# Altium schematic sheet Power.SchDoc
size 420 x 297 mm; SheetNumber: 2; SheetTotal: 4
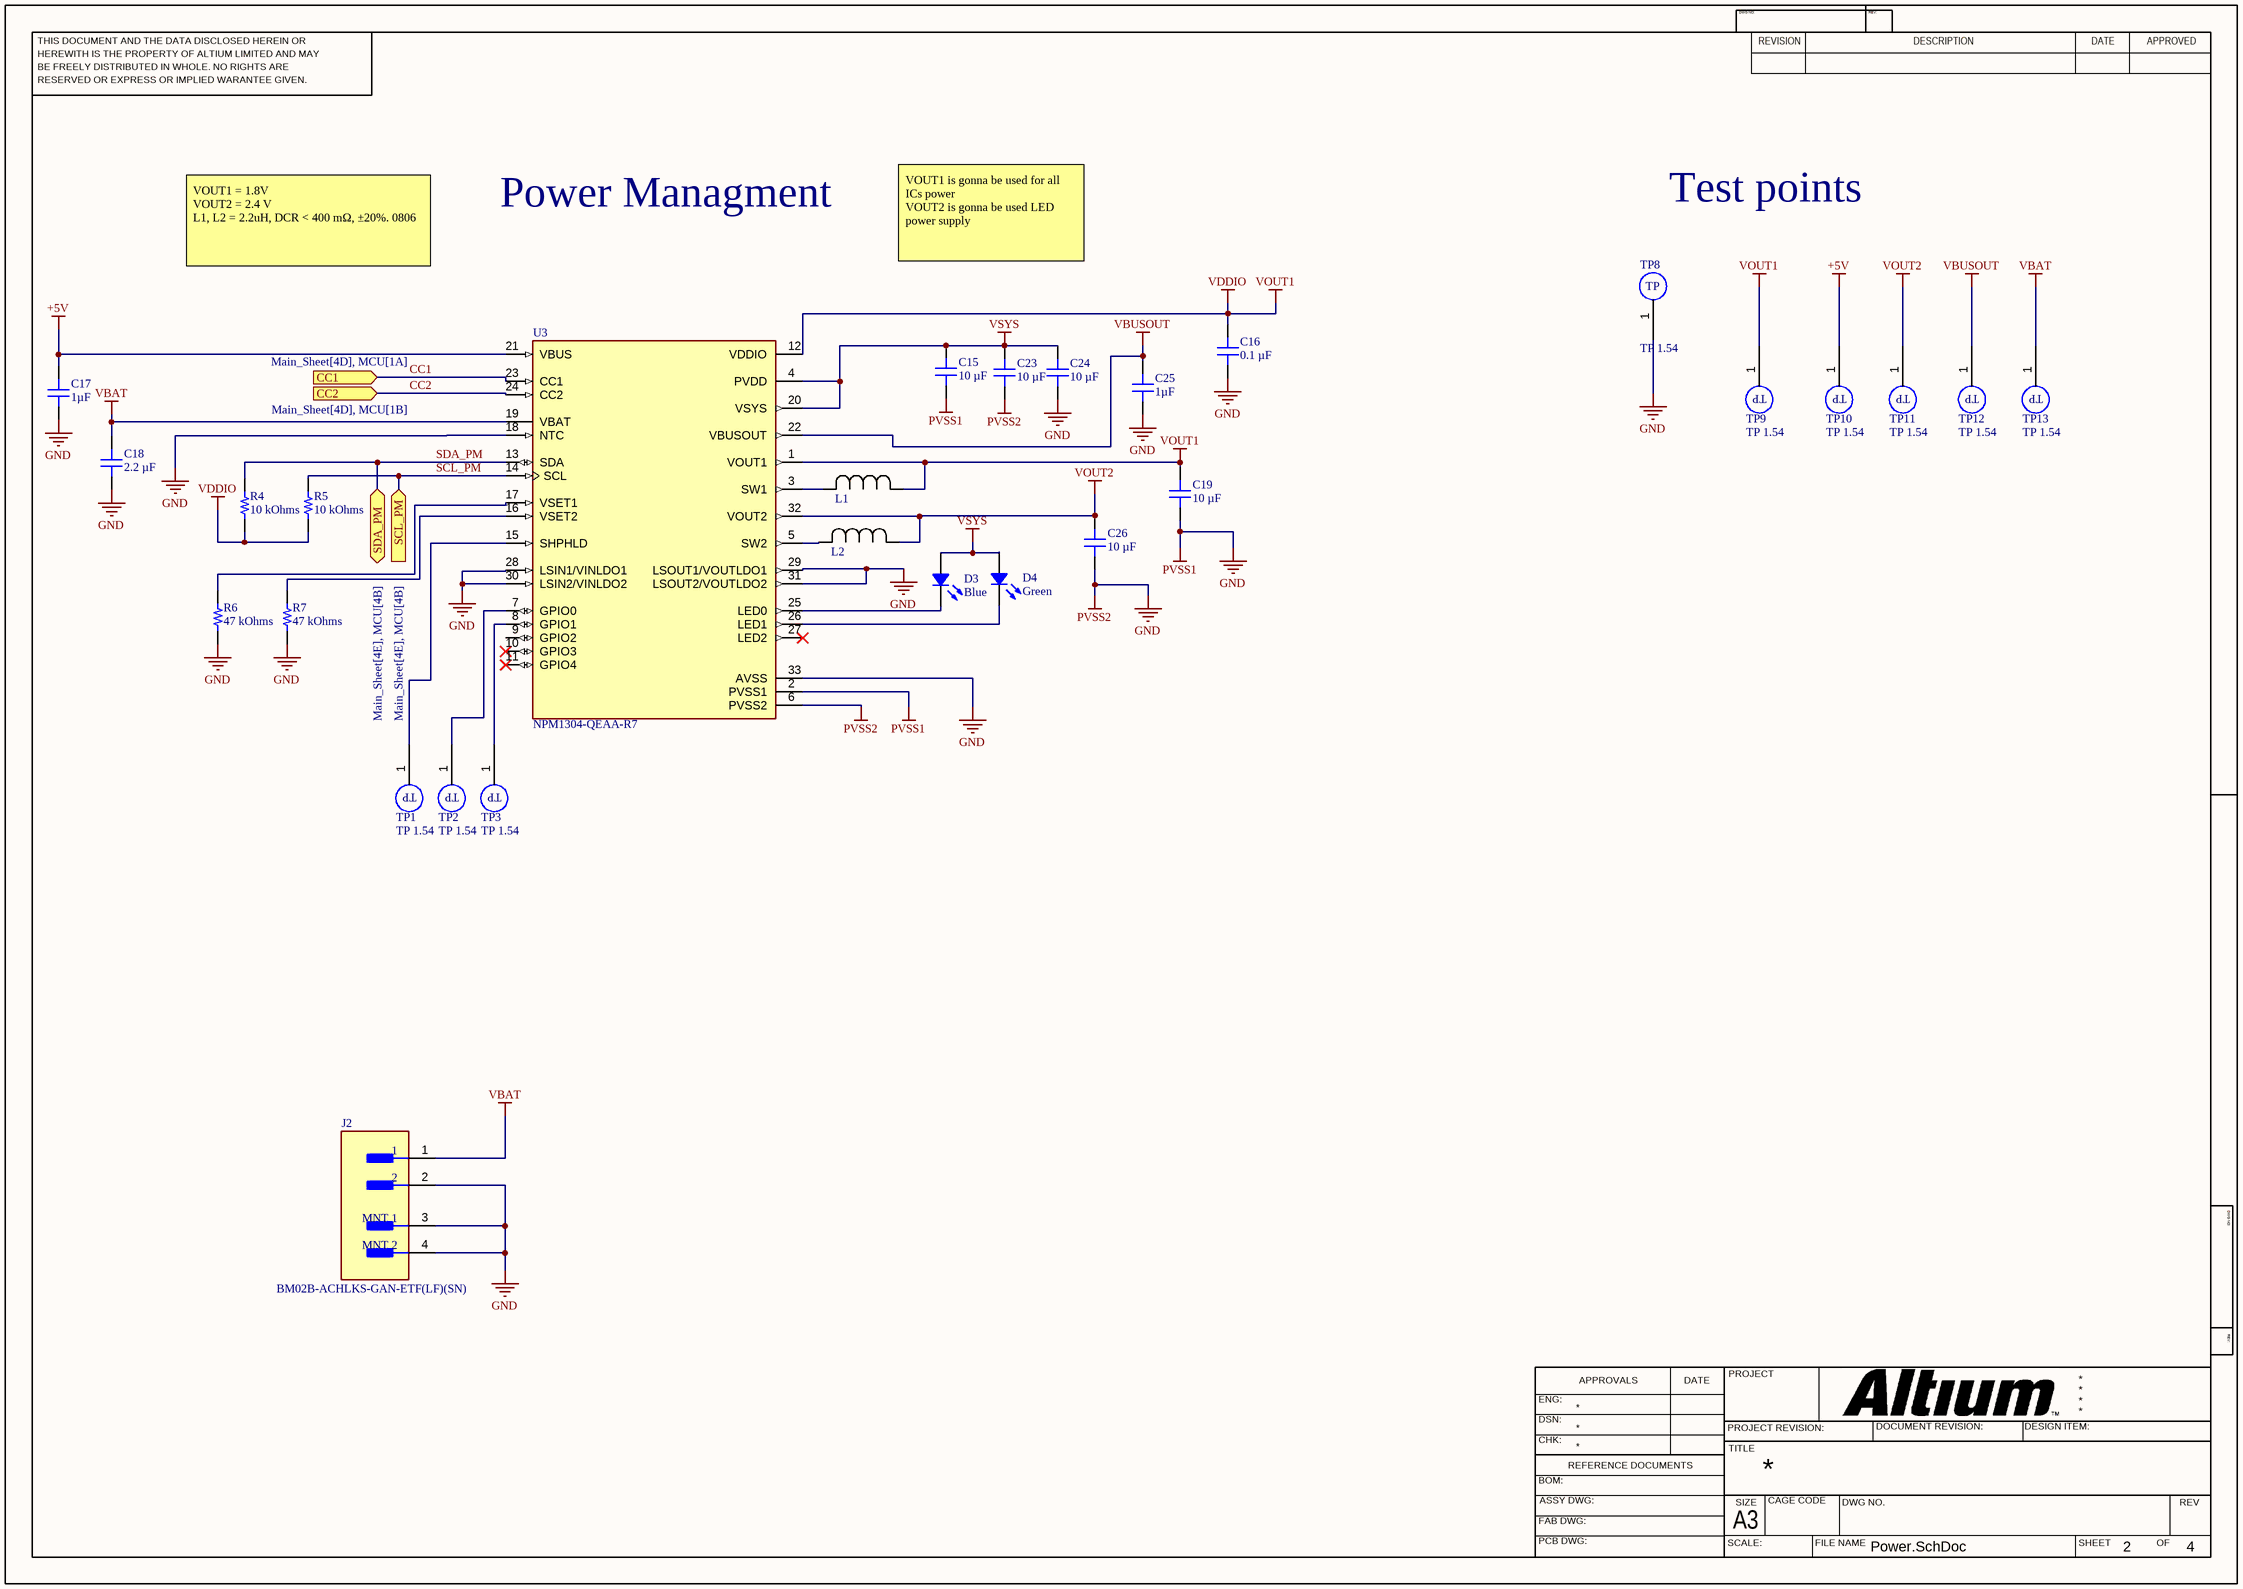
[diagram p0: Power.SchDoc]

## Parts
C15  10 µF  [MURATA GRT188 0603_1608]
C16  0.1 µF  [CAP 0402_1005]
C17  1µF  [CAP 0603_1608]
C18  2.2 µF  [CAP 0603_1608]
C19  10 µF  [MURATA GRT188 0603_1608]
C23  10 µF  [MURATA GRT188 0603_1608]
C24  10 µF  [MURATA GRT188 0603_1608]
C25  1µF  [CAP 0603_1608]
C26  10 µF  [MURATA GRT188 0603_1608]
D3  Blue  [LED 0402_1005 GREEN]
D4  Green  [LED 0402_1005 GREEN]
J2  BM02B-ACHLKS-GAN-ETF(LF)(SN)  [FP-BM02B-ACHLKS-GAN-ETF_L-MFG]
L1  CIGT201610EH2R2MNE  [IND_CIGT2016_SAM]  (value not drawn)
L2  CIGT201610EH2R2MNE  [IND_CIGT2016_SAM]  (value not drawn)
R4  10 kOhms  [RES 0402_1005]
R5  10 kOhms  [RES 0402_1005]
R6  47 kOhms  [RES 0402_1005]
R7  47 kOhms  [RES 0402_1005]
TP1  TP 1.54  [TP-Footprint-1]  (no BOM)
TP2  TP 1.54  [TP-Footprint-1]  (no BOM)
TP3  TP 1.54  [TP-Footprint-1]  (no BOM)
TP8  TP 1.54  [TP-Footprint-1]  (no BOM)
TP9  TP 1.54  [TP-Footprint-1]  (no BOM)
TP10  TP 1.54  [TP-Footprint-1]  (no BOM)
TP11  TP 1.54  [TP-Footprint-1]  (no BOM)
TP12  TP 1.54  [TP-Footprint-1]  (no BOM)
TP13  TP 1.54  [TP-Footprint-1]  (no BOM)
U3  NPM1304-QEAA-R7  [QFN50P500X500X90-33N]

## Ports
CC1 (in, see Main_Sheet[4D], MCU[1A]), CC2 (in, see Main_Sheet[4D], MCU[1B]), SCL_PM (in, see Main_Sheet[4E], MCU[4B]), SDA_PM (bidir, see Main_Sheet[4E], MCU[4B])

## Nets
+5V: C17.2 TP10.1 U3.21(VBUS)
GND: C15.1 C16.1 C17.1 C18.1 C19.1 C23.1 C24.1 C25.1 C26.1 J2.2 J2.3(MNT_1) J2.4(MNT_2) R6.1 R7.1 TP8.1 U3.2(PVSS1) U3.6(PVSS2) U3.18(NTC) U3.28(LSIN1/VINLDO1) U3.29(LSOUT1/VOUTLDO1) U3.30(LSIN2/VINLDO2) U3.31(LSOUT2/VOUTLDO2) U3.33(AVSS)  [also labelled PVSS1, PVSS2]
VBAT: C18.2 J2.1 TP13.1 U3.19(VBAT)
VBUSOUT: C25.2 TP12.1 U3.22(VBUSOUT)
VDDIO: C16.2 C19.2 L1.1 R4.1 R5.1 TP9.1 U3.1(VOUT1) U3.12(VDDIO)  [also labelled VOUT1]
VOUT2: C26.2 L2.1 TP11.1 U3.32(VOUT2)
VSYS: C15.2 C23.2 C24.2 D3.1 D4.1 U3.4(PVDD) U3.20(VSYS)
CC1: U3.23(CC1) ; port CC1
CC2: U3.24(CC2) ; port CC2
SCL_PM: R5.2 U3.14(SCL) ; port SCL_PM
SDA_PM: R4.2 U3.13(SDA) ; port SDA_PM
NetD3_2: D3.2 U3.25(LED0)
NetD4_2: D4.2 U3.26(LED1)
NetL1_2: L1.2 U3.3(SW1)
NetL2_2: L2.2 U3.5(SW2)
NetR6_2: R6.2 U3.17(VSET1)
NetR7_2: R7.2 U3.16(VSET2)
NetTP1_1: TP1.1 U3.15(SHPHLD)
NetTP2_1: TP2.1 U3.7(GPIO0)
NetTP3_1: TP3.1 U3.8(GPIO1)

Not connected (* = marked no-connect by the designer): U3 9(GPIO2) 10(GPIO3)* 11(GPIO4)* 27(LED2)*

## Notes on the sheet
- VOUT1 = 1.8V
  VOUT2 = 2.4 V
  L1, L2 = 2.2uH, DCR < 400 mΩ, ±20%. 0806
- Power Managment
- VOUT1 is gonna be used for all ICs power
  VOUT2 is gonna be used LED power supply
- Test points
- THIS DOCUMENT AND THE DATA DISCLOSED HEREIN OR
- HEREWITH IS THE PROPERTY OF ALTIUM LIMITED AND MAY
- DWG NO:
- REVISION
- REV:
- DESCRIPTION
- DATE
- APPROVED
- BE FREELY DISTRIBUTED IN WHOLE. NO RIGHTS ARE
- RESERVED OR EXPRESS OR IMPLIED WARANTEE GIVEN.
- ENG:
- APPROVALS
- PROJECT
- DSN:
- CHK:
- REFERENCE DOCUMENTS
- PROJECT REVISION:
- TITLE
- DOCUMENT REVISION:
- DESIGN ITEM:
- BOM:
- FAB DWG:
- PCB DWG:
- ASSY DWG:
- SCALE:
- A3
- SIZE
- CAGE CODE
- FILE NAME
- DWG NO.
- SHEET
- OF
- REV
- (in symbol TestPoint-1) TP

## Library data of the parts
C15 C19 C23 C24 C26 = GRT188R61C106ME13D: CAP CER 10UF 16V X5R 0603; manufacturer: Murata Electronics; Tolerance: ±20%; Part Number: GRT188R61C106ME13D; Capacitance: 10 µF; Applications: Automotive; componentlink1description: Datasheet; componentlink1url: https://search.murata.co.jp/Ceramy/image/img/A01X/G101/ENG/GRT188R61C106ME13-01.pdf; componentlink2description: DigiKey Link; componentlink2url: https://www.digikey.com/en/products/detail/murata-electronics/GRT188R61C106ME13D/5416740; Device Package: 0603 (1608 Metric); lastupdated: 7/27/2025 6:13:14 AM; Lifecycle Status: Active; Minimum Order: 1; Mounting Type: Surface Mount, MLCC; Operating Temperature: -55°C ~ 85°C; Package / Case: 0603 (1608 Metric); packaging: TapeAndReel; partid: 2515; Part Status: Active; price: 0.06; Ratings: AEC-Q200; series: GRT; Size / Dimension: 0.063" L x 0.031" W (1.60mm x 0.80mm); Supplier 1: DigiKey; Supplier Part Number 1: 490-12318-1-ND; Temperature Coefficient: X5R; Thickness (Max): 0.035" (0.90mm); value: 10 µF; Voltage - Rated: 16V
C16 = CL05B104KP5VPNC: CAP CER 100NF 10V X7R 0402; manufacturer: Samsung Electro-Mechanics; Temperature Coefficient: X5R; Tolerance: ±10%; Voltage - Rated: 16V; Part Number: CL05B104KP5VPNC; Capacitance: 0.1 µF; Applications: Automotive; componentlink1description: Datasheet; componentlink1url: https://mm.digikey.com/Volume0/opasdata/d220001/medias/docus/5458/CL05B104KP5VPNC_Spec.pdf; componentlink2description: DigiKey Link; componentlink2url: https://www.digikey.com/en/products/detail/samsung-electro-mechanics/CL05B104KP5VPNC/20498482; Device Package: 0402 (1005 Metric); lastupdated: 2/9/2024 8:03:17 PM; Lifecycle Status: Active; Minimum Order: 1; Mounting Type: Surface Mount, MLCC; Operating Temperature: -55°C ~ 125°C; Package / Case: 0402 (1005 Metric); packaging: TapeAndReel; partid: 56690; price: 0.01; Ratings: AEC-Q200; series: CL; Size / Dimension: 0.039" L x 0.020" W (1.00mm x 0.50mm); Supplier 1: DigiKey; Supplier Part Number 1: 1276-CL05B104KP5VPNCCT-ND; Thickness (Max): 0.022" (0.55mm); value: 0.1 µF
C17 = 06033D105MAT2A: CAP CER 1UF 25V X5R 0603; manufacturer: AVX Corporation; Tolerance: ±10%; Part Number: 06033D105MAT2A; Capacitance: 1µF; Applications: General Purpose; componentlink1description: Datasheet; componentlink1url: http://datasheets.avx.com/cx5r.pdf; componentlink2description: DigiKey Link; componentlink2url: http://digikey.com/product-detail/en/avx-corporation/06033D105MAT2A/478-4531-1-ND/1645882; Device Package: 0603 (1608 Metric); lastupdated: 9/2/2020 1:03:35 AM; Lifecycle Status: Active; Minimum Order: 1; Mounting Type: Surface Mount, MLCC; Operating Temperature: -55°C ~ 85°C; Package / Case: 0603 (1608 Metric); packaging: TapeAndReel; partid: 2656; Part Status: Active; price: 0.11; series: -; Size / Dimension: 0.063" L x 0.032" W (1.60mm x 0.81mm); Supplier 1: DigiKey; Supplier Part Number 1: 478-4531-1-ND; Temperature Coefficient: X5R; Thickness (Max): 0.035" (0.90mm); value: 1µF; Voltage - Rated: 25V
C18 = CGA3E3X5R1A225K080AB: CAP CER 2.2UF 10V X5R 0603; manufacturer: TDK Corporation; Temperature Coefficient: X7R; Tolerance: ±10%; Voltage - Rated: 16V; Part Number: CGA3E3X5R1A225K080AB; Capacitance: 2.2 µF; Applications: Automotive; componentlink1description: Datasheet; componentlink1url: https://product.tdk.com/info/en/catalog/datasheets/mlcc_automotive_general_en.pdf?ref_disty=digikey; componentlink2description: DigiKey Link; componentlink2url: https://www.digikey.com/en/products/detail/tdk-corporation/CGA3E3X5R1A225K080AB/3949680; Device Package: 0603 (1608 Metric); lastupdated: 2/9/2024 8:10:27 PM; Lifecycle Status: Active; Minimum Order: 1; Mounting Type: Surface Mount, MLCC; Operating Temperature: -55°C ~ 85°C; Package / Case: 0603 (1608 Metric); packaging: TapeAndReel; partid: 4737; Part Status: Active; price: 0.02; Ratings: AEC-Q200; series: CGA; Size / Dimension: 0.063" L x 0.031" W (1.60mm x 0.80mm); Supplier 1: DigiKey; Supplier Part Number 1: 445-12444-1-ND; Thickness (Max): 0.035" (0.90mm); value: 2.2 µF
C25 = 0603ZD105KAT4A: CAP CER 1UF 10V X5R 0603; manufacturer: AVX Corporation; Tolerance: ±10%; Part Number: 0603ZD105KAT4A; Capacitance: 1µF; Applications: General Purpose; componentlink1description: Datasheet; componentlink1url: http://datasheets.avx.com/cx5r.pdf; componentlink2description: DigiKey Link; componentlink2url: http://digikey.com/product-detail/en/avx-corporation/0603ZD105KAT4A/478-12460-1-ND/9749312; Device Package: 0603 (1608 Metric); lastupdated: 9/2/2020 1:03:32 AM; Lifecycle Status: Active; Minimum Order: 1; Mounting Type: Surface Mount, MLCC; Operating Temperature: -55°C ~ 85°C; Package / Case: 0603 (1608 Metric); packaging: TapeAndReel; partid: 4586; Part Status: Active; price: 0.03; series: -; Size / Dimension: 0.063" L x 0.032" W (1.60mm x 0.81mm); Supplier 1: DigiKey; Supplier Part Number 1: 478-12460-1-ND; Temperature Coefficient: X5R; Thickness (Max): 0.035" (0.90mm); value: 1µF; Voltage - Rated: 10V
D3 D4 = SM0402PGC: LED GREEN CLEAR 0402 SMD; Manufacturer: Bivar Inc.; Configuration: 0402; Current - Test: 20mA; Lens Color: Colorless; Lens Size: 0.50mm x 1.00mm; Lens Style: Rectangle with Flat Top; Millicandela Rating: 450mcd; Viewing Angle: 130°; Voltage - Forward (Vf) (Typ): 3.1V; Wavelength - Dominant: 525nm; Wavelength - Peak: 523nm; Part Number: SM0402PGC; Color: Green; ComponentLink1Description: Datasheet; ComponentLink1URL: https://www.bivar.com/Files/Datasheets/SM0402PGC.pdf; ComponentLink2Description: DigiKey Link; ComponentLink2URL: https://www.digikey.com/en/products/detail/bivar-inc/SM0402PGC/6810860; Device Package: 0402 (1005 Metric); Height (Max): 0.71mm; LastUpdated: 8/25/2025 8:34:13 PM; Lens Transparency: Clear; Lifecycle Status: Active; Minimum Order: 1; Mounting Type: Surface Mount; Package / Case: 0402 (1005 Metric); Packaging: TapeAndReel; PartId: 699; Part Status: Active; Price: 0.24; Series: -; Size / Dimension: 1.00mm L x 0.50mm W; Supplier 1: DigiKey; Supplier Part Number 1: 492-2204-1-ND; Supplier Device Package: 0402; Value: Green
J2 = CMP-17439-000451-1: CONN HEADER SMD R/A 2POS 1.2MM; Number of Positions: 2; Voltage Rating: 50V; Pitch: 0.047inch; Insulation Material: Thermoplastic; Contact Plating: Gold; Fastening Type: Detent; Connector Type: Header; Number of Pins: 2; Max Operating Temperature: 85°C; Min Operating Temperature: -25°C; Contact Type: Male Blade; Termination: Solder; Mount: Surface Mount; Contact Material: Copper Alloy; Color: Black; Contact Finish - Mating: GOLD; Series: ACHL; Insulation Color: Black; Lead Free: Lead Free; Flammability Rating: UL94 V-0; Contact Shape: Rectangular; Packaging: Cut Tape; Number of Rows: 1
L1 L2 = CMP-006-00022-1: Description; Manufacturer_Name: Samsung; Manufacturer_Part_Number: CIGT201610EH2R2MNE; Source: CIGT201610EH2R2MNE.SchLib; Copyright: Copyright (C) 2025 Ultra Librarian. All rights reserved.; Design Item ID: CIGT201610EH2R2MNE
R4 R5 = RP73PF1E10KBTD: RES 10K OHM 0.1% 1/10W 0402; Manufacturer: TE Connectivity Passive Product; Power (Watts): 0.1W, 1/10W; Temperature Coefficient: ±25ppm/°C; Tolerance: ±1%; Part Number: RP73PF1E10KBTD; Value: 10 kOhms; ComponentLink1Description: Datasheet; ComponentLink1URL: https://www.te.com/commerce/DocumentDelivery/DDEController?Action=srchrtrv&DocNm=1773272&DocType=DS&DocLang=English; ComponentLink2Description: DigiKey Link; ComponentLink2URL: https://www.digikey.com/en/products/detail/te-connectivity-passive-product/RP73PF1E10KBTD/8260957; Composition: Thin Film; Device Package: 0402 (1005 Metric); Height - Seated (Max): 0.014" (0.35mm); LastUpdated: 2/9/2024 8:30:24 PM; Lifecycle Status: Active; Minimum Order: 1; Number of Terminations: 2; Operating Temperature: -55°C ~ 155°C; Package / Case: 0402 (1005 Metric); Packaging: TapeAndReel; PartId: 2434; Part Status: Active; Price: 0.08; Resistance: 10 kOhms; Series: RP73, Holsworthy; Size / Dimension: 0.039" L x 0.020" W (1.00mm x 0.50mm); Supplier 1: DigiKey; Supplier Part Number 1: A127415CT-ND; Supplier Device Package: 0402
R6 R7 = RMCF0402FT47K0: RES 47K OHM 1% 1/16W 0402; Manufacturer: Stackpole Electronics Inc; Power (Watts): 0.063W, 1/16W; Temperature Coefficient: ±100ppm/°C; Part Number: RMCF0402FT47K0; Value: 47 kOhms; ComponentLink1Description: Datasheet; ComponentLink1URL: https://www.seielect.com/catalog/sei-rmcf_rmcp.pdf; ComponentLink2Description: DigiKey Link; ComponentLink2URL: https://www.digikey.com/en/products/detail/stackpole-electronics-inc/RMCF0402FT47K0/1714749; Composition: Thick Film; Device Package: 0402 (1005 Metric); Features: Automotive AEC-Q200; Height - Seated (Max): 0.016" (0.40mm); LastUpdated: 2/9/2024 8:30:13 PM; Lifecycle Status: Active; Minimum Order: 1; Number of Terminations: 2; Operating Temperature: -55°C ~ 155°C; Package / Case: 0402 (1005 Metric); Packaging: CutTape; PartId: 4957; Part Status: Active; Price: 0.01; Ratings: AEC-Q200; Resistance: 47 kOhms; Series: RMCF; Size / Dimension: 0.039" L x 0.020" W (1.00mm x 0.50mm); Supplier 1: DigiKey; Supplier Part Number 1: RMCF0402FT47K0CT-ND; Supplier Device Package: 0402; Tolerance: ±1%
TP1-TP3 TP8-TP13 = TestPoint-1: Rounded rectangular pad 1.54mm
U3 = CMP-031-00007-2: NPM1304 POWER MANAGEMENT IC; MF: Nordic Semiconductor ASA; SnapEDA_Link: https://www.snapeda.com/parts/NPM1304-QEAA-R7/Nordic+Power/view-part/?ref=snap; Pins: 33; Design Item ID: NPM1304-QEAA-R7; Case/Package: None; MP: NPM1304-QEAA-R7; Check_prices: https://www.snapeda.com/parts/NPM1304-QEAA-R7/Nordic+Power/view-part/?ref=eda; Source: NPM1304-QEAA-R7.SchLib; Value: *; Component Type: Standard